# Altium schematic sheet esp_sd_debug_adapter.SchDoc
size A4; Organization: Blinkinlabs, LLC
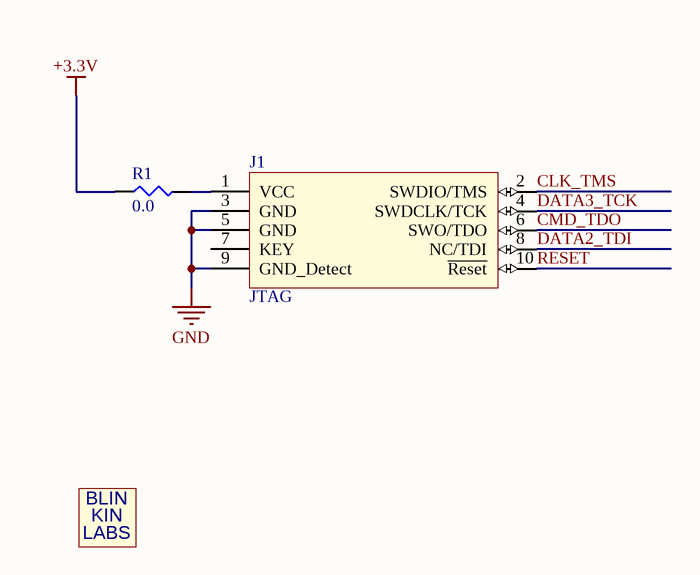
[diagram p0: esp_sd_debug_adapter.SchDoc]

## Parts
J1  JTAG  [1.27mm 2x5 SMD Header]
L?  BLINKINLABS_LOGO  [BLINKINLABS_LOGO]  (value not drawn)  (no BOM)
R1  0.0  [ERJ6G(0805)_L]

## Nets
+3.3V: R1.1
GND: J1.3(GND) J1.5(GND) J1.9(GND_Detect)
CLK_TMS: J1.2(SWDIO/TMS)
CMD_TDO: J1.6(SWO/TDO)
DATA2_TDI: J1.8(NC/TDI)
DATA3_TCK: J1.4(SWDCLK/TCK)
RESET: J1.10(~{Reset})
NetJ1_1: J1.1(VCC) R1.2

Not connected (* = marked no-connect by the designer): J1 7(KEY)

## Notes on the sheet
- Title:
- Project:
- Revision:
- Date:
- Time:
- Sheet
- of
- (in symbol BLINKINLABS_LOGO) BLIN; KIN; LABS

## Library data of the parts
J1 = ARM Cortex JTAG: Arm Cortex 10-pin JTAG connector; Manufacturer: Unknown/Generic; PartNumber: unknown/Generic
L? = BLINKINLABS_LOGO: Square logo
R1 = ERJ-6GEY0R00V: RES SMD 0.0 OHM JUMPER 1/8W 0805; Manufacturer: Panasonic Electronic Components; Power (Watts): 0.125W, 1/8W; PartNumber: ERJ-6GEY0R00V; Datasheets: http://industrial.panasonic.com/www-cgi/jvcr13pz.cgi?E+PZ+3+AOA0001+ERJ6GEY0R00V+7+WW; Image: //media.digikey.com/Renders/Panasonic%20Renders/ERJ-0805%20Pkg.jpg; Digi-Key Part Number: P0.0ACT-ND; Series: ERJ; Value: 0.0; Tolerance: Jumper; Composition: Thick Film; Features: Automotive AEC-Q200; Temperature Coefficient: -; Operating Temperature: -55°C ~ 155°C; Package / Case: 0805 (2012 Metric); Case/Package: 0805; Size / Dimension: 0.079" L x 0.049" W (2.00mm x 1.25mm); Height - Seated (Max): 0.028" (0.70mm); Number of Terminations: 2